# Altium schematic sheet TD.0002-100.SchDoc
size 420 x 297 mm; SheetNumber: {}; SheetTotal: {}; PageSetup: Record=PageOptions|CenterHorizontal=False|CenterVertical=False|PrintScale=0.95|XCorrection=0.00|YCorrection=0.00|PrintKind=1|BorderSize=5000000|LeftOffset=0|BottomOffset=0|Orientation=1|PaperLength=1000|PaperWidth=1000|Scale=100|PaperSource=15|PrintQuality=600|MediaType=1|DitherType=10|PaperKind=A4|PrintScaleMode=1; DocumentType1str: схема электрическая принципиальная; Rule: PcbType=ProtelPcb
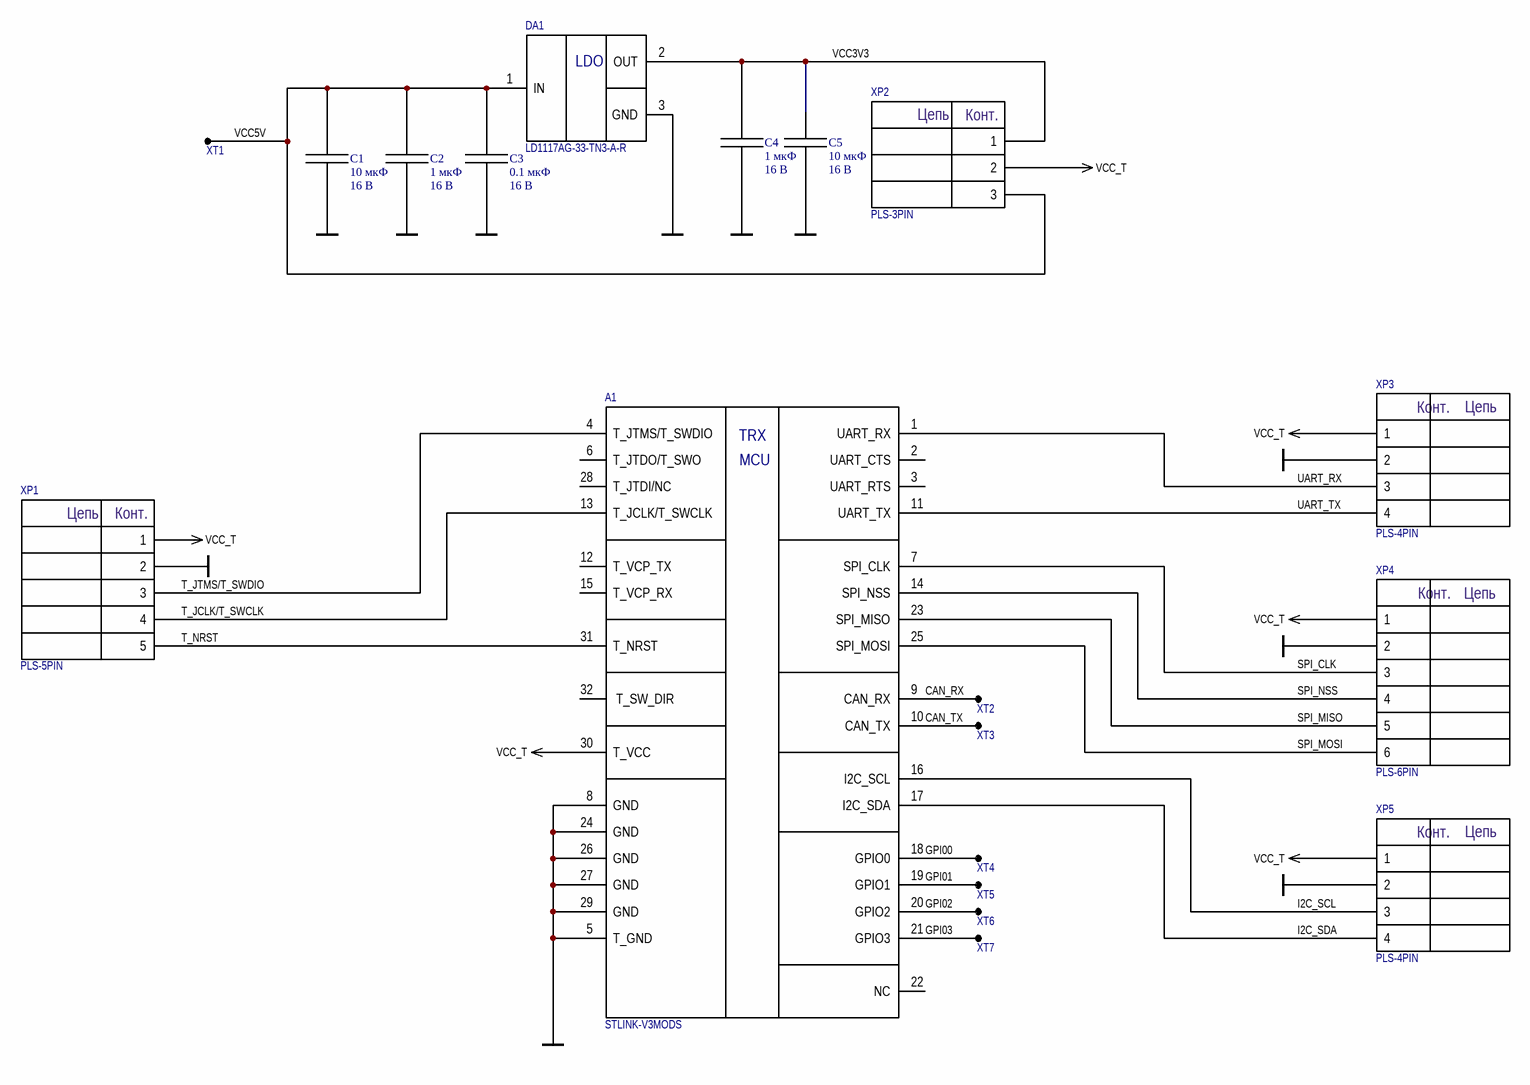
[diagram p0: TD.0002-100.SchDoc]

## Parts
A1  STLINK-V3MODS  [STLINK-V3MODS]
C1  value 10 мкФ  Voltage: 16 В  [C_0603]  (hidden comment: GRM188R61C106KAALD)
C2  value 1 мкФ  Voltage: 16 В  [C_0402]  (hidden comment: GRM155R61C105KA12D)
C3  value 0.1 мкФ  Voltage: 16 В  [C_0402]  (hidden comment: GRM155R71C104KA88D)
C4  value 1 мкФ  Voltage: 16 В  [C_0402]  (hidden comment: GRM155R61C105KA12D)
C5  value 10 мкФ  Voltage: 16 В  [C_0603]  (hidden comment: GRM188R61C106KAALD)
DA1  LD1117AG-33-TN3-A-R  [TO-252]
XP1  PLS-5PIN  [PLS-5PIN]
XP2  PLS-3PIN  [PLS-3PIN]
XP3  PLS-4PIN  [PLS-4PIN]
XP4  PLS-6PIN  [PLS-6PIN]
XP5  PLS-4PIN  [PLS-4PIN]
XT1  pad  [PAD_2X2mm]  (value not drawn)
XT2  pad  [pad_3x1mm]  (value not drawn)
XT3  pad  [pad_3x1mm]  (value not drawn)
XT4  pad  [pad_3x1mm]  (value not drawn)
XT5  pad  [pad_3x1mm]  (value not drawn)
XT6  pad  [pad_3x1mm]  (value not drawn)
XT7  pad  [pad_3x1mm]  (value not drawn)

## Nets
GND: A1.5(T_GND) A1.8(GND) A1.24(GND) A1.26(GND) A1.27(GND) A1.29(GND) C1.2 C2.2 C3.2 C4.2 C5.2 DA1.3(GND) XP1.2 XP3.2 XP4.2 XP5.2
VCC_T: A1.30(T_VCC) XP1.1 XP2.2 XP3.1 XP4.1 XP5.1
CAN_RX: A1.9(CAN_RX) XT2.1
CAN_TX: A1.10(CAN_TX) XT3.1
GPI00: A1.18(GPIO0) XT4.1
GPI01: A1.19(GPIO1) XT5.1
GPI02: A1.20(GPIO2) XT6.1
GPI03: A1.21(GPIO3) XT7.1
I2C_SCL: A1.16(I2C_SCL) XP5.3
I2C_SDA: A1.17(I2C_SDA) XP5.4
SPI_CLK: A1.7(SPI_CLK) XP4.3
SPI_MISO: A1.23(SPI_MISO) XP4.5
SPI_MOSI: A1.25(SPI_MOSI) XP4.6
SPI_NSS: A1.14(SPI_NSS) XP4.4
T_JCLK/T_SWCLK: A1.13(T_JCLK/T_SWCLK) XP1.4
T_JTMS/T_SWDIO: A1.4(T_JTMS/T_SWDIO) XP1.3
T_NRST: A1.31(T_NRST) XP1.5
UART_RX: A1.1(UART_RX) XP3.3
UART_TX: A1.11(UART_TX) XP3.4
VCC3V3: C4.1 C5.1 DA1.2(OUT) XP2.1
VCC5V: C1.1 C2.1 C3.1 DA1.1(IN) XP2.3 XT1.1

Not connected (* = marked no-connect by the designer): A1 2(UART_CTS) 3(UART_RTS) 6(T_JTDO/T_SWO) 12(T_VCP_TX) 15(T_VCP_RX) 22(NC) 28(T_JTDI/NC) 32(_T_SW_DIR)

## Notes on the sheet
- Перв. примен.
- Справ. №
- Подп. и дата
- Инв. № дубл.
- Взам. инв. №
- Изм.
- Лист
- № докум.
- Подп.
- Дата
- Лит.
- Масса
- Масштаб
- Т.контр.
- Пров.
- Разраб.
- Листов
- Инв. № подл.
- Н.контр.
- Утв.
- Копировал
- Формат А3
- (in symbol LD1117AG-33-TN3-A-R) LDO
- (in symbol PLS-3PIN) Цепь; Конт.
- (in symbol PLS-4PIN) Конт.; Цепь
- (in symbol PLS-5PIN) Цепь; Конт.
- (in symbol PLS-6PIN) Конт.; Цепь
- (in symbol STLINK-V3MODS) TRX; MCU

## Library data of the parts
A1 = STLINK-V3MODS: Mini debuggers/programmers for STM32; Manufactorer: STMicroelectronics; Type: Программатор
C1 C5 = GRM188R61C106KAALD: Chip Monolithic Ceramic Capacitor; Manufacturer: Murata; TC: X5R; Temperature coefficient: ±15%; Tolerance: 0,1; Type: Конденсатор керамический; Operating temperature: -55 … 85 °C; Part Number: GRM188R61C106KAALD; Library Ref: *; Library Path: *; Package: SMD 0603
C2 C4 = GRM155R61C105KA12D: Chip Multilayer Ceramic Capacitors; Manufacturer: Murata; TC: X5R; Temperature coefficient: ±15%; Tolerance: 0,1; Type: Конденсатор керамический; Operating temperature: -55 … 85 °C; Part Number: GRM155R61C105KA12D; Library Ref: *; Library Path: *; Package: SMD 0402
C3 = GRM155R71C104KA88D: Chip Multilayer Ceramic Capacitors; Manufacturer: Murata; TC: X7R; Temperature coefficient: ±15%; Tolerance: 0,1; Type: Конденсатор керамический; Operating temperature: -55 … 125 °C; Part Number: GRM155R71C104KA88D; Library Ref: *; Library Path: *; Package: SMD 0402
DA1 = LD1117AG-33-TN3-A-R: Low drop fixed and adjustable positive voltage regulators; Manufactorer: UTC; Maximum input voltage: 18 В; Output voltage: 3,3 В; Current limit: 1000 мA; Operating Junction Temperature: 0 ... +125 °C; Type: Линейный регулятор напряжения с низким падением
XP1 = PLS-5PIN: Шаг ножек: 2,54 мм
XP2 = PLS-3PIN: Шаг ножек: 2,54 мм
XP3 XP5 = PLS-4PIN: Шаг ножек: 2,54 мм
XP4 = PLS-6PIN: Шаг ножек: 2,54 мм